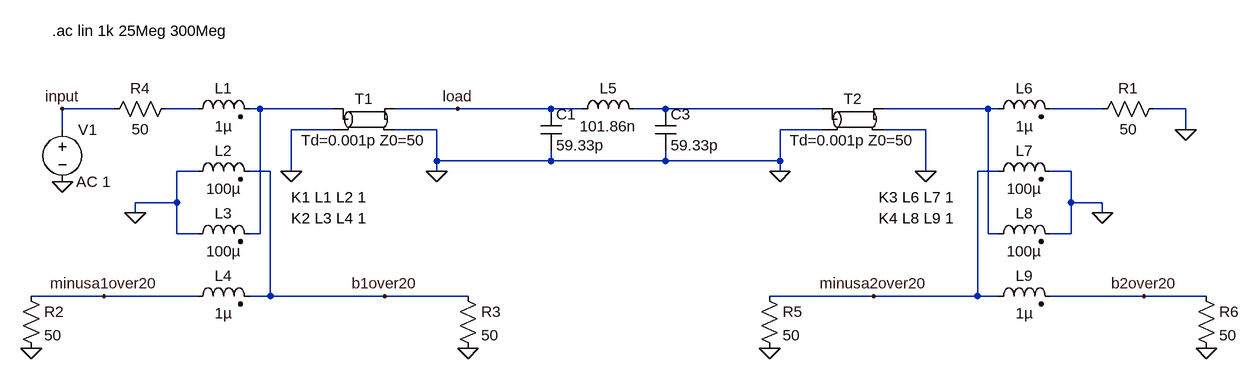
[diagram p0: schematic filter_vna.asc]
filter_vna.asc, the LTspice schematic file:
Version 4
SHEET 1 1828 680
WIRE 96 128 16 128
WIRE 224 128 176 128
WIRE 320 128 304 128
WIRE 432 128 320 128
WIRE 624 128 528 128
WIRE 768 128 624 128
WIRE 816 128 768 128
WIRE 944 128 896 128
WIRE 1184 128 944 128
WIRE 1440 128 1280 128
WIRE 1456 128 1440 128
WIRE 1616 128 1536 128
WIRE 1744 128 1696 128
WIRE 16 160 16 128
WIRE 432 160 368 160
WIRE 592 160 528 160
WIRE 1184 160 1120 160
WIRE 1344 160 1280 160
WIRE 1744 160 1744 128
WIRE 592 208 592 160
WIRE 768 208 768 192
WIRE 768 208 592 208
WIRE 944 208 944 192
WIRE 944 208 768 208
WIRE 1120 208 1120 160
WIRE 1120 208 944 208
WIRE 224 224 192 224
WIRE 336 224 304 224
WIRE 368 224 368 160
WIRE 592 224 592 208
WIRE 1120 224 1120 208
WIRE 1344 224 1344 160
WIRE 1456 224 1424 224
WIRE 1568 224 1536 224
WIRE 192 272 192 224
WIRE 192 272 128 272
WIRE 1568 272 1568 224
WIRE 1616 272 1568 272
WIRE 128 288 128 272
WIRE 1616 288 1616 272
WIRE 192 320 192 272
WIRE 224 320 192 320
WIRE 320 320 320 128
WIRE 320 320 304 320
WIRE 1440 320 1440 128
WIRE 1456 320 1440 320
WIRE 1568 320 1568 272
WIRE 1568 320 1536 320
WIRE 80 416 -32 416
WIRE 224 416 80 416
WIRE 336 416 336 224
WIRE 336 416 304 416
WIRE 512 416 336 416
WIRE 640 416 512 416
WIRE 1264 416 1104 416
WIRE 1424 416 1424 224
WIRE 1424 416 1264 416
WIRE 1456 416 1424 416
WIRE 1680 416 1536 416
WIRE 1776 416 1680 416
FLAG 16 240 0
FLAG 128 288 0
FLAG -32 496 0
FLAG 640 496 0
FLAG 592 224 0
FLAG 368 224 0
FLAG 16 128 input
FLAG 624 128 load
FLAG 512 416 b1over20
FLAG 80 416 minusa1over20
FLAG 1120 224 0
FLAG 1344 224 0
FLAG 1104 496 0
FLAG 1776 496 0
FLAG 1616 288 0
FLAG 1744 160 0
FLAG 1264 416 minusa2over20
FLAG 1680 416 b2over20
SYMBOL Res 192 112 R90
WINDOW 0 0 56 VBottom 2
WINDOW 3 32 56 VTop 2
SYMATTR InstName R4
SYMATTR Value 50
SYMBOL Voltage 16 144 R0
WINDOW 3 24 96 Invisible 2
WINDOW 123 21 96 Left 2
SYMATTR Value ""
SYMATTR Value2 AC 1
SYMATTR InstName V1
SYMBOL ind2 208 144 R270
WINDOW 0 32 56 VTop 2
WINDOW 3 5 56 VBottom 2
SYMATTR InstName L1
SYMATTR Value 1µ
SYMATTR Type ind
SYMBOL ind2 208 240 R270
WINDOW 0 32 56 VTop 2
WINDOW 3 5 56 VBottom 2
SYMATTR InstName L2
SYMATTR Value 100µ
SYMATTR Type ind
SYMBOL ind2 208 336 R270
WINDOW 0 32 56 VTop 2
WINDOW 3 5 56 VBottom 2
SYMATTR InstName L3
SYMATTR Value 100µ
SYMATTR Type ind
SYMBOL ind2 208 432 R270
WINDOW 0 32 56 VTop 2
WINDOW 3 5 56 VBottom 2
SYMATTR InstName L4
SYMATTR Value 1µ
SYMATTR Type ind
SYMBOL Res -48 400 R0
SYMATTR InstName R2
SYMATTR Value 50
SYMBOL Res 624 400 R0
SYMATTR InstName R3
SYMATTR Value 50
SYMBOL tline 480 144 R0
SYMATTR InstName T1
SYMATTR Value Td=0.001p Z0=50
SYMBOL Cap 752 128 R0
SYMATTR InstName C1
SYMATTR Value 59.33p
SYMBOL Cap 928 128 R0
SYMATTR InstName C3
SYMATTR Value 59.33p
SYMBOL Ind 800 144 R270
WINDOW 0 32 56 VTop 2
WINDOW 3 5 56 VBottom 2
SYMATTR InstName L5
SYMATTR Value 101.86n
SYMBOL tline 1232 144 R0
SYMATTR InstName T2
SYMATTR Value Td=0.001p Z0=50
SYMBOL ind2 1440 144 R270
WINDOW 0 32 56 VTop 2
WINDOW 3 5 56 VBottom 2
SYMATTR InstName L6
SYMATTR Value 1µ
SYMATTR Type ind
SYMBOL Res 1600 144 R270
WINDOW 0 32 56 VTop 2
WINDOW 3 0 56 VBottom 2
SYMATTR InstName R1
SYMATTR Value 50
SYMBOL ind2 1440 240 R270
WINDOW 0 32 56 VTop 2
WINDOW 3 5 56 VBottom 2
SYMATTR InstName L7
SYMATTR Value 100µ
SYMATTR Type ind
SYMBOL ind2 1440 336 R270
WINDOW 0 32 56 VTop 2
WINDOW 3 5 56 VBottom 2
SYMATTR InstName L8
SYMATTR Value 100µ
SYMATTR Type ind
SYMBOL ind2 1440 432 R270
WINDOW 0 32 56 VTop 2
WINDOW 3 5 56 VBottom 2
SYMATTR InstName L9
SYMATTR Value 1µ
SYMATTR Type ind
SYMBOL Res 1088 400 R0
SYMATTR InstName R5
SYMATTR Value 50
SYMBOL Res 1760 400 R0
SYMATTR InstName R6
SYMATTR Value 50
TEXT 0 8 Left 2 !.ac lin 1k 25Meg 300Meg
TEXT 368 264 Left 2 !K1 L1 L2 1
TEXT 368 296 Left 2 !K2 L3 L4 1
TEXT 1272 264 Left 2 !K3 L6 L7 1
TEXT 1272 296 Left 2 !K4 L8 L9 1

The netlist it stands for:
* filter_vna.asc
R4 N001 input 50
V1 input 0 AC 1
L1 N001 N002 1µ
L2 0 b1over20 100µ
L3 0 N002 100µ
L4 minusa1over20 b1over20 1µ
R2 minusa1over20 0 50
R3 b1over20 0 50
T1 N002 0 load 0 Td=0.001p Z0=50
C1 load 0 59.33p
C3 N003 0 59.33p
L5 load N003 101.86n
T2 N003 0 N004 0 Td=0.001p Z0=50
L6 N004 N005 1µ
R1 N005 0 50
L7 minusa2over20 0 100µ
L8 N004 0 100µ
L9 minusa2over20 b2over20 1µ
R5 minusa2over20 0 50
R6 b2over20 0 50
.ac lin 1k 25Meg 300Meg
K1 L1 L2 1
K2 L3 L4 1
K3 L6 L7 1
K4 L8 L9 1
.backanno
.end